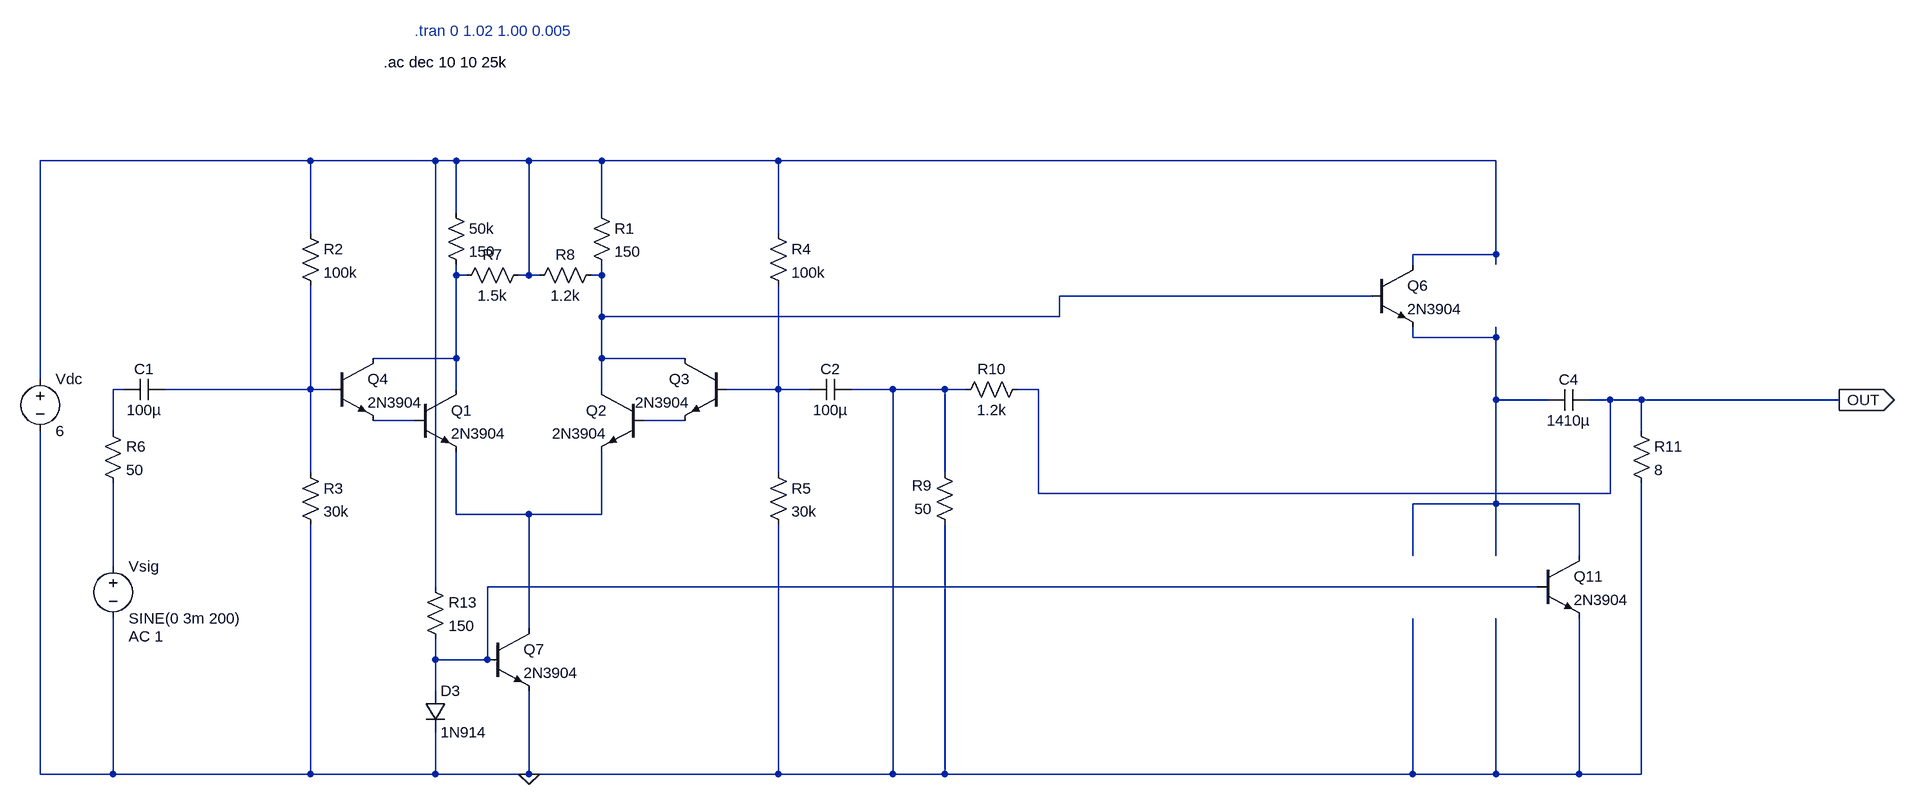
[diagram p0: schematic DiffPair_A.asc]
DiffPair_A.asc, the LTspice schematic file:
Version 4
SHEET 1 2616 880
WIRE 16 -112 -400 -112
WIRE 208 -112 16 -112
WIRE 240 -112 208 -112
WIRE 352 -112 240 -112
WIRE 464 -112 352 -112
WIRE 736 -112 464 -112
WIRE 1840 -112 736 -112
WIRE 240 -32 240 -112
WIRE 464 -32 464 -112
WIRE 16 0 16 -112
WIRE 736 0 736 -112
WIRE 1840 32 1840 -112
WIRE 1840 32 1712 32
WIRE 1712 48 1712 32
WIRE 1840 48 1840 32
WIRE 240 64 240 48
WIRE 256 64 240 64
WIRE 352 64 352 -112
WIRE 352 64 336 64
WIRE 368 64 352 64
WIRE 464 64 464 48
WIRE 464 64 448 64
WIRE 1648 96 1168 96
WIRE 464 128 464 64
WIRE 880 128 464 128
WIRE 1168 128 1168 96
WIRE 1168 128 880 128
WIRE 1712 160 1712 144
WIRE 1840 160 1840 144
WIRE 1840 160 1712 160
WIRE 240 192 240 64
WIRE 240 192 112 192
WIRE 464 192 464 128
WIRE 592 192 464 192
WIRE -400 224 -400 -112
WIRE -272 240 -288 240
WIRE 16 240 16 80
WIRE 16 240 -208 240
WIRE 32 240 16 240
WIRE 48 240 32 240
WIRE 240 240 240 192
WIRE 464 240 464 192
WIRE 704 240 656 240
WIRE 736 240 736 80
WIRE 736 240 704 240
WIRE 784 240 736 240
WIRE 912 240 848 240
WIRE 992 240 912 240
WIRE 1024 240 992 240
WIRE 1136 240 1104 240
WIRE 1840 256 1840 160
WIRE 1920 256 1840 256
WIRE 2016 256 1984 256
WIRE 2064 256 2016 256
WIRE 2368 256 2064 256
WIRE 176 288 112 288
WIRE 592 288 528 288
WIRE -288 304 -288 240
WIRE 2064 304 2064 256
WIRE 16 368 16 240
WIRE 736 368 736 240
WIRE 992 368 992 240
WIRE 1136 400 1136 240
WIRE 2016 400 2016 256
WIRE 2016 400 1136 400
WIRE 1840 416 1840 256
WIRE 1840 416 1712 416
WIRE 1968 416 1840 416
WIRE 240 432 240 336
WIRE 304 432 240 432
WIRE 352 432 304 432
WIRE 464 432 464 336
WIRE 464 432 352 432
WIRE 1712 496 1712 416
WIRE 1840 496 1840 416
WIRE 1968 496 1968 416
WIRE -288 512 -288 384
WIRE 208 544 208 -112
WIRE 1904 544 288 544
WIRE 352 608 352 432
WIRE 208 656 208 624
WIRE 288 656 288 544
WIRE 288 656 208 656
WIRE 208 704 208 656
WIRE -400 832 -400 304
WIRE -288 832 -288 592
WIRE -288 832 -400 832
WIRE 16 832 16 448
WIRE 16 832 -288 832
WIRE 208 832 208 768
WIRE 208 832 16 832
WIRE 352 832 352 704
WIRE 352 832 208 832
WIRE 736 832 736 448
WIRE 736 832 352 832
WIRE 912 832 912 240
WIRE 912 832 736 832
WIRE 992 832 992 448
WIRE 992 832 912 832
WIRE 1712 832 1712 592
WIRE 1712 832 992 832
WIRE 1840 832 1840 592
WIRE 1840 832 1712 832
WIRE 1968 832 1968 592
WIRE 1968 832 1840 832
WIRE 2064 832 2064 384
WIRE 2064 832 1968 832
FLAG 352 832 0
FLAG 2368 256 OUT
IOPIN 2368 256 Out
DATAFLAG 880 128 ""
DATAFLAG 704 240 ""
DATAFLAG 32 240 ""
DATAFLAG 304 432 ""
SYMBOL npn 176 240 R0
SYMATTR InstName Q1
SYMATTR Value 2N3904
SYMBOL npn 528 240 M0
SYMATTR InstName Q2
SYMATTR Value 2N3904
SYMBOL npn 656 192 M0
SYMATTR InstName Q3
SYMATTR Value 2N3904
SYMBOL npn 48 192 R0
SYMATTR InstName Q4
SYMATTR Value 2N3904
SYMBOL res 448 -48 R0
SYMATTR InstName R1
SYMATTR Value 150
SYMBOL voltage -400 208 R0
WINDOW 123 0 0 Left 2
WINDOW 39 0 0 Left 2
SYMATTR InstName Vdc
SYMATTR Value 6
SYMBOL cap -208 224 R90
WINDOW 0 0 32 VBottom 2
WINDOW 3 32 32 VTop 2
SYMATTR InstName C1
SYMATTR Value 100µ
SYMBOL voltage -288 496 R0
WINDOW 123 24 124 Left 2
WINDOW 39 0 0 Left 2
SYMATTR Value2 AC 1
SYMATTR InstName Vsig
SYMATTR Value SINE(0 3m 200)
SYMBOL res 0 -16 R0
SYMATTR InstName R2
SYMATTR Value 100k
SYMBOL res 0 352 R0
SYMATTR InstName R3
SYMATTR Value 30k
SYMBOL cap 848 224 R90
WINDOW 0 0 32 VBottom 2
WINDOW 3 32 32 VTop 2
SYMATTR InstName C2
SYMATTR Value 100µ
SYMBOL res 720 -16 R0
SYMATTR InstName R4
SYMATTR Value 100k
SYMBOL res 720 352 R0
SYMATTR InstName R5
SYMATTR Value 30k
SYMBOL res -304 288 R0
SYMATTR InstName R6
SYMATTR Value 50
SYMBOL cap 1984 240 R90
WINDOW 0 0 32 VBottom 2
WINDOW 3 32 32 VTop 2
SYMATTR InstName C4
SYMATTR Value 1410µ
SYMBOL res 1008 464 R180
WINDOW 0 36 76 Left 2
WINDOW 3 36 40 Left 2
SYMATTR InstName R9
SYMATTR Value 50
SYMBOL res 1120 224 R90
WINDOW 0 0 56 VBottom 2
WINDOW 3 32 56 VTop 2
SYMATTR InstName R10
SYMATTR Value 1.2k
SYMBOL res 224 -48 R0
SYMATTR InstName 50k
SYMATTR Value 150
SYMBOL npn 288 608 R0
SYMATTR InstName Q7
SYMATTR Value 2N3904
SYMBOL diode 192 704 R0
SYMATTR InstName D3
SYMATTR Value 1N914
SYMBOL res 192 528 R0
SYMATTR InstName R13
SYMATTR Value 150
SYMBOL npn 1648 48 R0
SYMATTR InstName Q6
SYMATTR Value 2N3904
SYMBOL npn 1904 496 R0
SYMATTR InstName Q11
SYMATTR Value 2N3904
SYMBOL res 352 48 R90
WINDOW 0 0 56 VBottom 2
WINDOW 3 32 56 VTop 2
SYMATTR InstName R7
SYMATTR Value 1.5k
SYMBOL res 464 48 R90
WINDOW 0 0 56 VBottom 2
WINDOW 3 32 56 VTop 2
SYMATTR InstName R8
SYMATTR Value 1.2k
SYMBOL res 2048 288 R0
SYMATTR InstName R11
SYMATTR Value 8
TEXT 176 -312 Left 2 ;.tran 0 1.02 1.00 0.005
TEXT 128 -264 Left 2 !.ac dec 10 10 25k

The netlist it stands for:
* DiffPair_A.asc
Q1 N002 N008 N010 0 2N3904
Q2 N003 N009 N010 0 2N3904
Q3 N003 N007 N009 0 2N3904
Q4 N002 N006 N008 0 2N3904
R1 N001 N003 150
Vdc N001 0 6
C1 N006 N005 100µ
Vsig N011 0 SINE(0 3m 200) AC 1
R2 N001 N006 100k
R3 N006 0 30k
C2 0 N007 100µ
R4 N001 N007 100k
R5 N007 0 30k
R6 N005 N011 50
C4 OUT N004 1410µ
R9 0 0 50
R10 OUT 0 1.2k
R§50k N001 N002 150
Q7 N010 N012 0 0 2N3904
D3 N012 0 1N914
R13 N001 N012 150
Q6 N001 N003 N004 0 2N3904
Q11 N004 N012 0 0 2N3904
R7 N001 N002 1.5k
R8 N003 N001 1.2k
R11 OUT 0 8
.model D D
.lib standard.dio
.model NPN NPN
.model PNP PNP
.lib standard.bjt
* .tran 0 1.02 1.00 0.005
.ac dec 10 10 25k
.backanno
.end